# EAGLE design Nano_Isp (EAGLE 9.6.0)
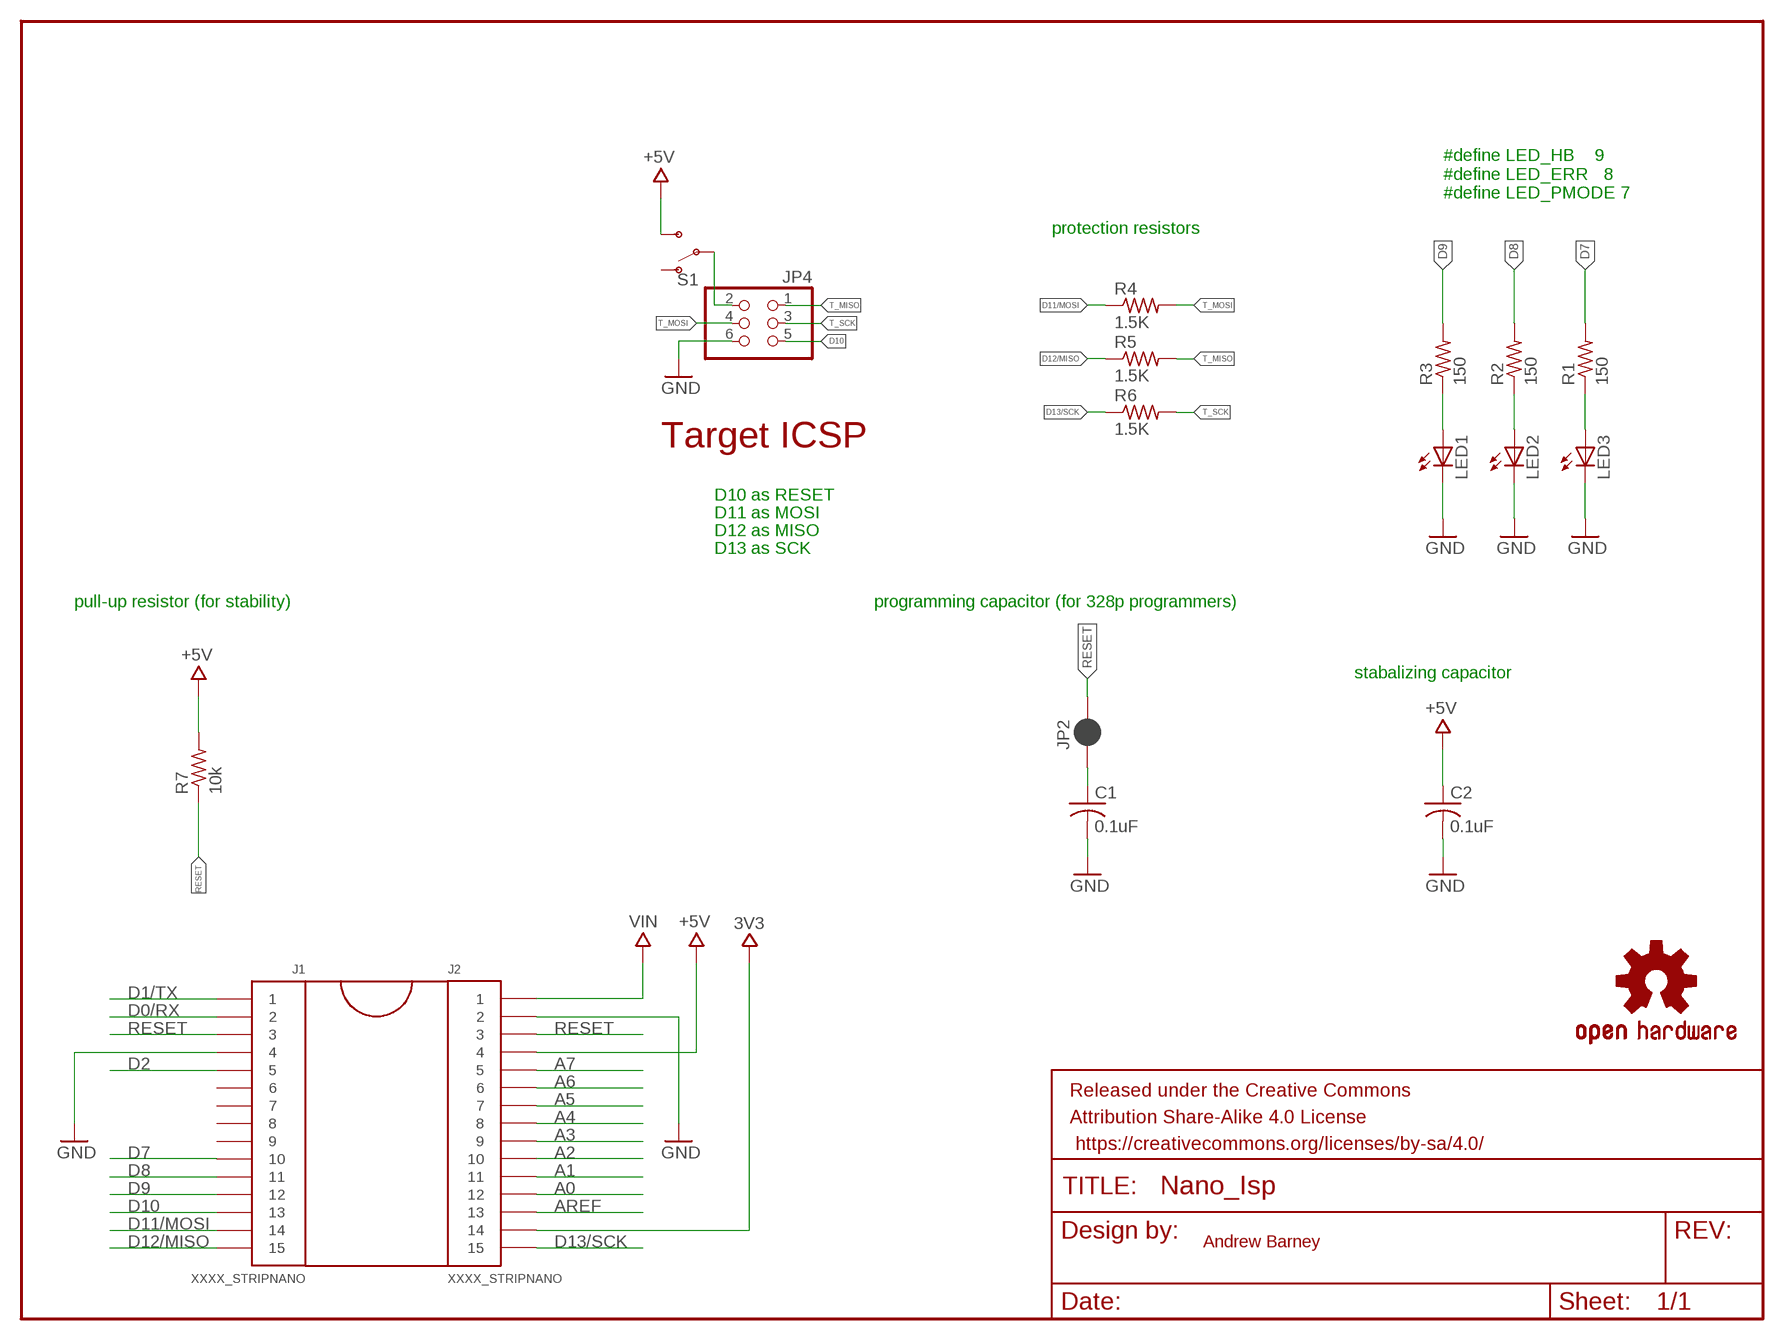
[diagram p0: schematic, sheet 1]

## Parts
C1  0.1uF  C-USC0805  [C0805]
C2  0.1uF  C-USC0805  [C0805]
FRAME1  FRAME-LETTERNO_PACKAGE  [DUMMY]
J1  XXXX_STRIPNANO  [HEAD15-NOSS]
J2  XXXX_STRIPNANO  [HEAD15-NOSS]
JP2  JUMPER-SMT_2_NC_PASTE_SILK  [SMT-JUMPER_2_NC_PASTE_SILK]
JP4  PINHD-2X3  [2X03]
LED1  LEDCHIP-LED0805  [CHIP-LED0805]
LED2  LEDCHIP-LED0805  [CHIP-LED0805]
LED3  LEDCHIP-LED0805  [CHIP-LED0805]
R1  150  R-US_R0805  [R0805]
R2  150  R-US_R0805  [R0805]
R3  150  R-US_R0805  [R0805]
R4  1.5K  R-US_R0805  [R0805]
R5  1.5K  R-US_R0805  [R0805]
R6  1.5K  R-US_R0805  [R0805]
R7  10k  R-US_R0805  [R0805]
S1  SWITCH-SPDT-SMD-AYZ0202  [SWITCH_DPDT_SMD_AYZ0202]
U$9  OSHW-LOGOS  [OSHW-LOGO-S]

## Nets
3V3: J2.14
+5V: C2.1 J2.4 R7.2 S1.3(S)
A0: J2.12
A1: J2.11
A2: J2.10
A3: J2.9
A4: J2.8
A5: J2.7
A6: J2.6
A7: J2.5
AREF: J2.13
D0/RX: J1.2
D1/TX: J1.1
D2: J1.5
D7: J1.10 R1.2
D8: J1.11 R2.2
D9: J1.12 R3.2
D10: J1.13 JP4.5
D11/MOSI: J1.14 R4.1
D12/MISO: J1.15 R5.1
D13/SCK: J2.15 R6.1
GND [vcc]: C1.2 C2.2 J1.4 J2.2 JP4.6 LED1.C LED2.C LED3.C
N$1: LED3.A R1.1
N$2: LED2.A R2.1
N$3: LED1.A R3.1
N$4: C1.1 JP2.1
RESET: J1.3 J2.3 JP2.2 R7.1
T_MISO: JP4.1 R5.2
T_MOSI: JP4.4 R4.2
T_SCK: JP4.3 R6.2
VCC2: JP4.2 S1.2(P)
VIN: J2.1
Unconnected: J1.6 J1.7 J1.8 J1.9 S1.1(O)

## Notes on the sheet
- #define LED_HB    9
  #define LED_ERR   8
  #define LED_PMODE 7
- protection resistors
- Target ICSP
- D10 as RESET
- D11 as MOSI
- D12 as MISO
- D13 as SCK
- pull-up resistor (for stability) | programming capacitor (for 328p programmers)
- stabalizing capacitor
- Andrew Barney

## Library data of the parts
C1 C2 = adafruit:C-US: CAPACITOR, American symbol
FRAME1 = SparkFun-Aesthetics:FRAME-LETTER: Schematic Frame - Letter Standard 8.5x11 US Letter frame; DESIGNER: Nobody; VERSION: v01
J1 J2 = Connettori:XXXX_STRIPNANO: Strip passo 2,54 a 15 pin per Arduino Nano; VALUE: Strip15pin
JP2 = SparkFun-Jumpers:JUMPER-SMT_2_NC_PASTE: Normally closed solder jumper This jumper has an aperture in the stencil to allow solder paste to bridge the split in the wire so it's normally closed (NC). Wick off the solder to open the connection. Reapply solder to reclose the connection.
JP4 = pinhead-ez:PINHD-2X3: PIN HEADER
LED1-LED3 = adafruit:LED: LED OSRAM: - CHIPLED LG R971, LG N971, LY N971, LG Q971, LY Q971, LO R971, LY R971 LH N974, LH R974 LS Q976, LO Q976, LY Q976 LO Q996 - Hyper CHIPLED LW Q18S LB Q993, LB Q99A, LB R99A - SideLED LS A670, LO A670, LY A670, LG A670, LP A670 LB A673, LV A673, LT A673, LW A673 LH A674 LY A675 LS A676, LA A676, LO A676, LY A676, LW A676 LS A679, LY A679, LG A679 - Hyper Micro SIDELED® LS Y876, LA Y876, LO Y876, LY Y876 LT Y87S - SmartLED LW L88C, LW L88S LB L89C, LB L89S, LG L890 LS L89K, LO L89K, LY L89K LS L896, LA L896, LO L896, LY L896 - TOPLED LS T670, LO T670, LY T670, LG T670, LP T670 LSG T670, LSP T670, LSY T670, LOP T670, LYG T670 LG T671, LOG T671, LSG T671 LB T673, LV T673, LT T673, LW T673 LH T674 LS T676, LA T676, LO T676, LY T676, LB T676, LH T676, LSB T676, LW T676 LB T67C, LV T67C, LT T67C, LS T67K, LO T67K, LY T67K, LW E67C LS E67B, LA E67B, LO E67B, LY E67B, LB E67C, LV E67C, LT E67C LW T67C LS T679, LY T679, LG T679 LS T770, LO T770, LY T770, LG T770, LP T770 LB T773, LV T773, LT T773, LW T773 LH T774 LS E675, LA E675, LY E675, LS T675 LS T776, LA T776, LO T776, LY T776, LB T776 LHGB T686 LT T68C, LB T68C - Hyper Mini TOPLED® LB M676 - Mini TOPLED Santana® LG M470 LS M47K, LO M47K, LY M47K Source: http://www.osram.convergy.de/
R1-R7 = rcl-ez:R-US_: RESISTOR, American symbol
S1 = SparkFun-Switches:SWITCH-SPDT: Single Pole, Double Throw (SPDT) Switch Single-pole, double-throw (SPDT) switch. Variant Overview SMD-AYZ0202 Surface Mount DPDT Switch <https://www.sparkfun.com/products/597> (COM-00597) Used on e.g. LilyPad Arduino USB - ATmega32U4 Board <https://www.sparkfun.com/products/12049> PTH-11.6X4.0MM SPDT Mini Power Switch <https://www.sparkfun.com/products/102> (COM-00102) Used on e.g. SparkFun Simon Says - Through-Hole Soldering Kit <https://www.sparkfun.com/products/10547> (KIT-10547) PTH-11.6X4.0MM-KIT KIT version of SPDT Mini Power Switch - Simplifies soldering by removing tStop of switch pins - only one side can be soldered. PTH-11.6X4.0MM-LOCK LOCK version of SPDT Mini Power Switch - Offset pins hold switch in place for easier soldering. SMD-RIGHT-ANGLE Surface Mount Right Angle Switch <https://www.sparkfun.com/products/10860> (COM-10860) Used on e.g. SparkFun ESP8266 Thing <https://www.sparkfun.com/products/13231>; PROD_ID: SWCH-08179; SF_ID: COM-00597
U$9 = SparkFun:OSHW-LOGO: Open Source Hardware Logo This logo indicates the piece of hardware it is found on incorporates a OSHW license and/or adheres to the definition of open source hardware found here: http://freedomdefined.org/OSHW

## Net classes
1 vcc: width 0.254 mm

## Board
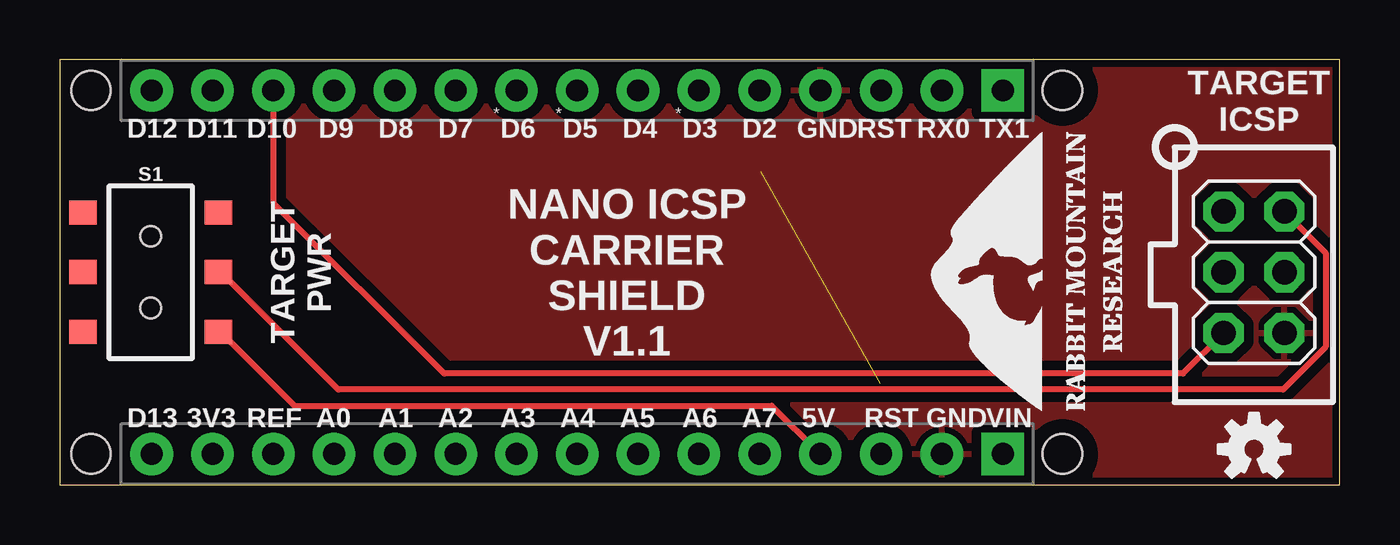
[diagram p1: board, top side]
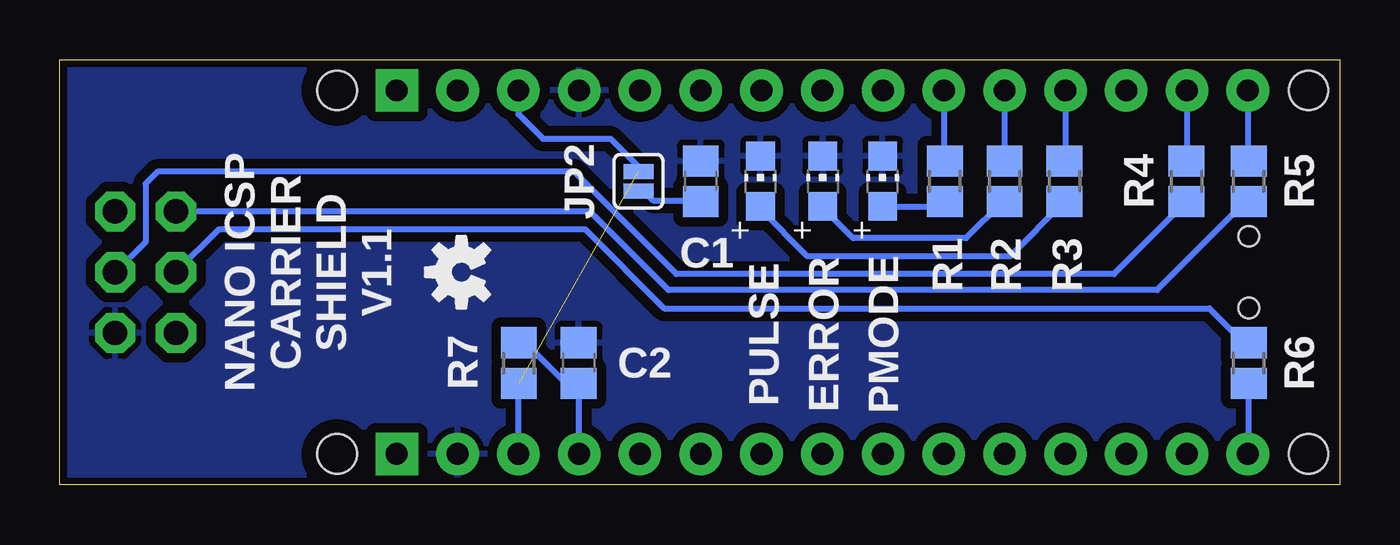
[diagram p2: board, bottom side, seen from below]

Size 53.48 x 17.78 mm. Coordinates in mm from the lower left corner, seen from the top.
Outline: 0,17.78 0,0 53.48,0 53.48,17.78 0,17.78
Copper layers (1*16): Top 0.035mm / dielectric 1.5mm / Bottom 0.035mm
Design rules "default *": minimum track width 10mil, minimum drill 16mil, track to track 16mil, track to pad 8mil, pad to pad 8mil, via to via 8mil, smd to smd 8mil, copper to edge 12mil, drill to drill 8mil, minimum pad ring 12mil, minimum via ring 8mil, stop-mask expansion 0mil, vias tented up to drill 24mil, thermal gap 10mil
Holes 1.65 mm at 1.3,16.5 1.3,1.3 41.9,1.3 41.9,16.5
tRestrict: area 0.1,15.4 to 2.4,17.7; area 40.8,0.1 to 43.1,2.4; area 0.1,0.1 to 2.4,2.4; area 40.8,15.4 to 43.1,17.7
bRestrict: area 0.1,0.1 to 2.4,2.4; area 0.1,15.4 to 2.4,17.7; area 40.8,15.4 to 43.1,17.7; area 40.8,0.1 to 43.1,2.4

### Footprints (pad centres in the part's own frame; a part is rotated, then mirrored left to right if it is on the bottom)
C0805 = smd 1.3 x 1.5: 1 -0.85,0; 2 0.85,0
HEAD15-NOSS = drill 0.914 pad 1.778 square: 1 0,0 | drill 0.914 pad 1.778: 2 2.54,0; 3 5.08,0; 4 7.62,0; 5 10.16,0; 6 12.7,0; 7 15.24,0; 8 17.78,0; 9 20.32,0; 10 22.86,0; 11 25.4,0; 12 27.94,0; 13 30.48,0; 14 33.02,0; 15 35.56,0
SMT-JUMPER_2_NC_PASTE_SILK = smd 0.635 x 1.27: 1 -0.406,0; 2 0.406,0
2X03 = drill 1.016 pad 1.676 octagon: 1 -2.54,-1.27; 2 -2.54,1.27; 3 0,-1.27; 4 0,1.27; 5 2.54,-1.27; 6 2.54,1.27
CHIP-LED0805 = smd 1.2 x 1.2: A 0,-1.05; C 0,1.05
R0805 = smd 1.3 x 1.5: 1 -0.85,0; 2 0.85,0
SWITCH_DPDT_SMD_AYZ0202 = smd 1 x 1.15: 1 -2.5,2.825; 2 0,2.825; 3 2.5,2.825; 4 -2.5,-2.825; 5 0,-2.825; 6 2.5,-2.825 | hole 0.85: 1.5,0; -1.5,0

### Placement (x,y rotation side)
C1  26.7,12.7 90 bottom
C2  31.8,5.1 90 bottom
FRAME1  -0.3,-0.3 0 top
J1  39.4,16.5 180 top
J2  39.4,1.3 180 top
JP2  29.3,12.7 90 bottom
JP4  49.9,8.9 270 top
LED1  24.2,12.7 0 bottom
LED2  21.6,12.7 0 bottom
LED3  19.1,12.7 0 bottom
R1  16.5,12.7 90 bottom
R2  14,12.7 90 bottom
R3  11.5,12.7 90 bottom
R4  6.4,12.7 270 bottom
R5  3.8,12.7 270 bottom
R6  3.8,5.1 90 bottom
R7  34.3,5.1 90 bottom
S1  3.8,8.9 270 top
U$1  [RMR-SIT-8MM]  44.4,3.1 90 top
U$2  OSHW-LOGOS  [OSHW-LOGO-S]  36.7,8.9 90 bottom
U$9  49.9,1.5 0 top

### Tracks (layer width: path | path; a pad name or v marks a point on that pad's centre or on a via)
+5V
  Top 0.254: S1.3 6.72,6.4 9.81,3.32 29.75,3.32 31.76,1.3 J2.4
  Bottom 0.254: J2.4 31.78,4 | 31.78,4 31.78,4.23 C2.1 | R7.2 34.18,5.83 33.91,5.83 32.08,4 31.78,4
D7
  Bottom 0.254: J1.10 16.54,13.55 R1.2
D8
  Bottom 0.254: J1.11 R2.2
D9
  Bottom 0.254: R3.2 11.46,13.59 J1.12
D10
  Top 0.254: J1.13 8.92,11.8 16.06,4.66 46.93,4.66 JP4.5
D11/MOSI
  Bottom 0.254: J1.14 6.38,13.57 R4.1
D12/MISO
  Bottom 0.254: J1.15 3.84,13.59 R5.1
D13/SCK
  Bottom 0.254: J2.15 3.8,1.34 R6.1
GND
  pour Top (isolate 0.203): -0.45,18.22 53.98,18.37 53.98,-0.4 -0.45,-0.55
  pour Bottom (isolate 0.203): -0.15,17.83 53.63,17.98 53.63,-0.14 -0.15,-0.3
N$1
  Bottom 0.254: R1.1 16.7,11.65 LED3.A
N$2
  Bottom 0.254: LED2.A 21.6,11.58 20.34,10.32 15.61,10.32 14.08,11.85 R2.1
N$3
  Bottom 0.254: LED1.A 24.2,11.53 22.23,9.56 13.79,9.56 R3.1
N$4
  Bottom 0.254: C1.1 26.75,11.9 28.69,11.9 29.04,12.25 29,12.29 JP2.1
RESET  (1 unrouted)
  Bottom 0.254: J2.3 34.32,4.23 R7.1 | J1.3 34.32,15.5 33.29,14.47 30.47,14.47 29.3,13.31 JP2.2
T_MISO
  Bottom 0.254: JP4.1 31.34,11.44 28.04,8.15 7.63,8.15 3.93,11.85 R5.2
T_MOSI
  Bottom 0.254: R4.2 9.43,8.82 27.72,8.82 32,13.1 49.4,13.1 49.9,12.6 49.9,10.16 51.16,8.9 JP4.4
T_SCK
  Bottom 0.254: R6.2 4,5.95 5.44,7.39 28.22,7.39 31.53,10.7 46.83,10.7 JP4.3
VCC2
  Top 0.254: JP4.2 52.9,9.71 52.9,5.78 51.11,3.99 11.63,3.99 6.72,8.9 S1.2
  Bottom 0.254: JP4.2

### Text on the board
tPlace: * | * | * | TARGET / ICSP | D12 | D11 | D10 | D9 | D8 | D7 | D6 | D5 | D4 | D3 | D2 | GND | RST | RX0 | TX1 | TARGET / PWR | NANO ICSP / CARRIER / SHIELD / V1.1 | D13 | 3V3 | REF | A0 | A1 | A2 | A3 | A4 | A5 | A6 | A7 | 5V | RST | GND | VIN
bPlace: NANO ICSP / CARRIER / SHIELD / V1.1 | PMODE | ERROR | PULSE
tTest: OSHW / Andrew Barney / Revised: Nov-24-2021 / RabbitMountainResearch.com
test-probe: NANO / TEST POINTS | 10 | 9 | 8 | 7 | 6 | 5 | 4 | 3 | 2 | GND1 | RESET | 0 | 1 | USB_D- | USB_D+ | USB_GND | ISP1_5 | ISP1_4 | ISP1_3 | USB_5V | ISP1_1 | 3V3 | AREF | A0 | A1 | A2 | A3 | A4 | A5 | A6 | A7 | 5V_REF | DC_VIN- | DC_VIN+